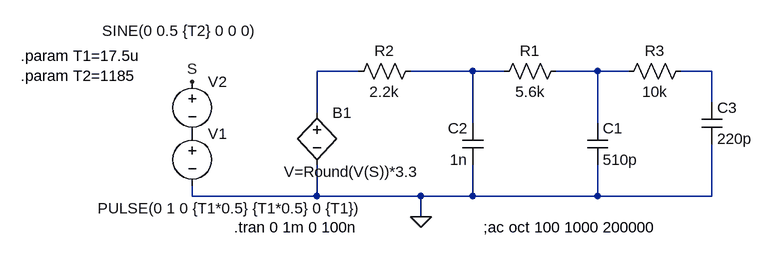
[diagram p0: schematic filter4.asc]
filter4.asc, the LTspice schematic file:
Version 4
SHEET 1 880 680
WIRE -128 64 -192 64
WIRE 48 64 -48 64
WIRE 96 64 48 64
WIRE 240 64 176 64
WIRE 288 64 240 64
WIRE 416 64 368 64
WIRE 416 112 416 64
WIRE -192 128 -192 64
WIRE 48 144 48 64
WIRE 240 144 240 64
WIRE -384 256 -384 240
WIRE -192 256 -192 208
WIRE -192 256 -384 256
WIRE -32 256 -192 256
WIRE 48 256 48 208
WIRE 48 256 -32 256
WIRE 240 256 240 208
WIRE 240 256 48 256
WIRE 416 256 416 176
WIRE 416 256 240 256
WIRE -32 288 -32 256
FLAG -32 288 0
FLAG -384 80 S
SYMBOL res 192 48 R90
WINDOW 0 0 56 VBottom 2
WINDOW 3 32 56 VTop 2
SYMATTR InstName R1
SYMATTR Value 5.6k
SYMBOL res -32 48 R90
WINDOW 0 0 56 VBottom 2
WINDOW 3 32 56 VTop 2
SYMATTR InstName R2
SYMATTR Value 2.2k
SYMBOL cap 224 144 R0
SYMATTR InstName C1
SYMATTR Value 510p
SYMBOL cap 64 208 R180
WINDOW 0 24 56 Left 2
WINDOW 3 24 8 Left 2
SYMATTR InstName C2
SYMATTR Value 1n
SYMBOL res 384 48 R90
WINDOW 0 0 56 VBottom 2
WINDOW 3 32 56 VTop 2
SYMATTR InstName R3
SYMATTR Value 10k
SYMBOL cap 400 112 R0
SYMATTR InstName C3
SYMATTR Value 220p
SYMBOL bv -192 112 R0
WINDOW 3 -51 107 Left 2
SYMATTR InstName B1
SYMATTR Value V=Round(V(S))*3.3
SYMBOL voltage -384 144 R0
WINDOW 3 -146 131 Left 2
WINDOW 123 0 0 Left 2
WINDOW 39 0 0 Left 2
SYMATTR InstName V1
SYMATTR Value PULSE(0 1 0 {T1*0.5} {T1*0.5} 0 {T1})
SYMBOL voltage -384 64 R0
WINDOW 3 -139 -62 Left 2
WINDOW 123 0 0 Left 2
WINDOW 39 0 0 Left 2
SYMATTR InstName V2
SYMATTR Value SINE(0 0.5 {T2} 0 0 0)
TEXT 64 304 Left 2 !;ac oct 100 1000 200000
TEXT -320 304 Left 2 !.tran 0 1m 0 100n
TEXT -648 40 Left 2 !.param T1=17.5u\n.param T2=1185

The netlist it stands for:
* filter4.asc
R1 N003 N002 5.6k
R2 N002 N001 2.2k
C1 N003 0 510p
C2 0 N002 1n
R3 N004 N003 10k
C3 N004 0 220p
B1 N001 0 V=Round(V(S))*3.3
V1 P001 0 PULSE(0 1 0 {T1*0.5} {T1*0.5} 0 {T1})
V2 S P001 SINE(0 0.5 {T2} 0 0 0)
;ac oct 100 1000 200000
.tran 0 1m 0 100n
.param T1=17.5u
.param T2=1185
.backanno
.end